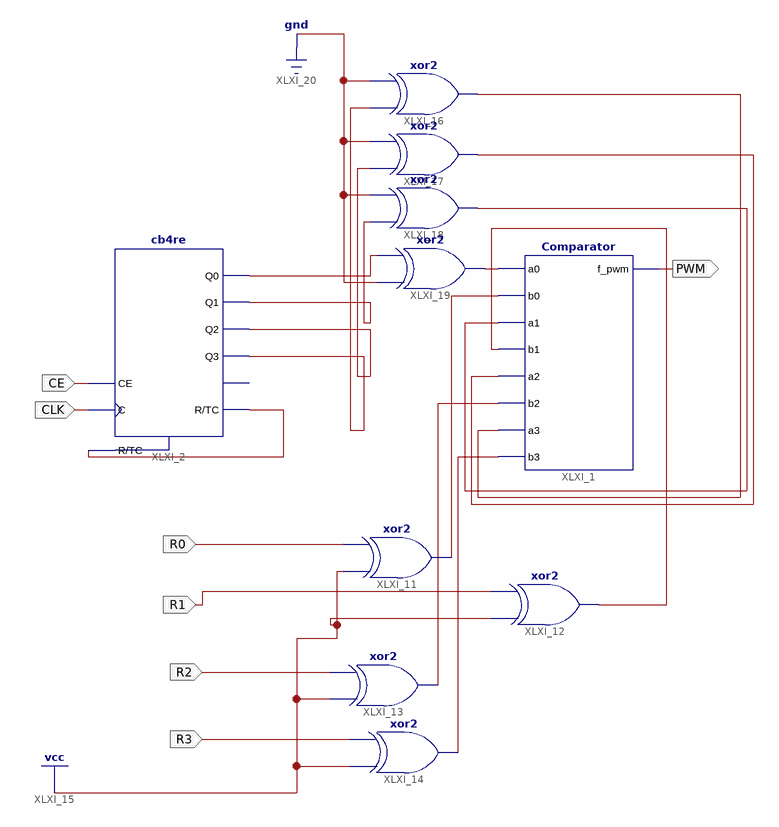
[diagram p0: schematic sheet 1]
// Xilinx ISE schematic PWM_NB_2.sch (spartan3e) as structural Verilog: 10 symbols, 7 ports
module PWM_NB_2 (
  input  CLK,
  input  CE,
  input  R3,
  input  R2,
  input  R0,
  input  R1,
  output PWM
);

  wire Chk, p0, p1, p2, p3, q0, q1, q2, q3, XLXN_31, XLXN_38, XLXN_39, XLXN_40;

  Comparator XLXI_1 (
    .a0(XLXN_31), .b0(p0), .a1(XLXN_38), .b1(p1), .a2(XLXN_39), .b2(p2), .a3(XLXN_40), .b3(p3), .f_pwm(PWM));
  cb4re XLXI_2 (.C(CLK), .CE(CE), .R(Chk), .Q0(q0), .Q1(q1), .Q2(q2), .Q3(q3), .TC(Chk));  // open: CEO
  xor XLXI_11 (p0, 1'b1, R0);
  xor XLXI_13 (p2, 1'b1, R2);
  xor XLXI_14 (p3, 1'b1, R3);
  xor XLXI_12 (p1, 1'b1, R1);
  xor XLXI_16 (XLXN_40, q3, 1'b0);
  xor XLXI_17 (XLXN_39, q2, 1'b0);
  xor XLXI_18 (XLXN_38, q1, 1'b0);
  xor XLXI_19 (XLXN_31, 1'b0, q0);
endmodule
